# EAGLE design peppermill (EAGLE 9.6.2)
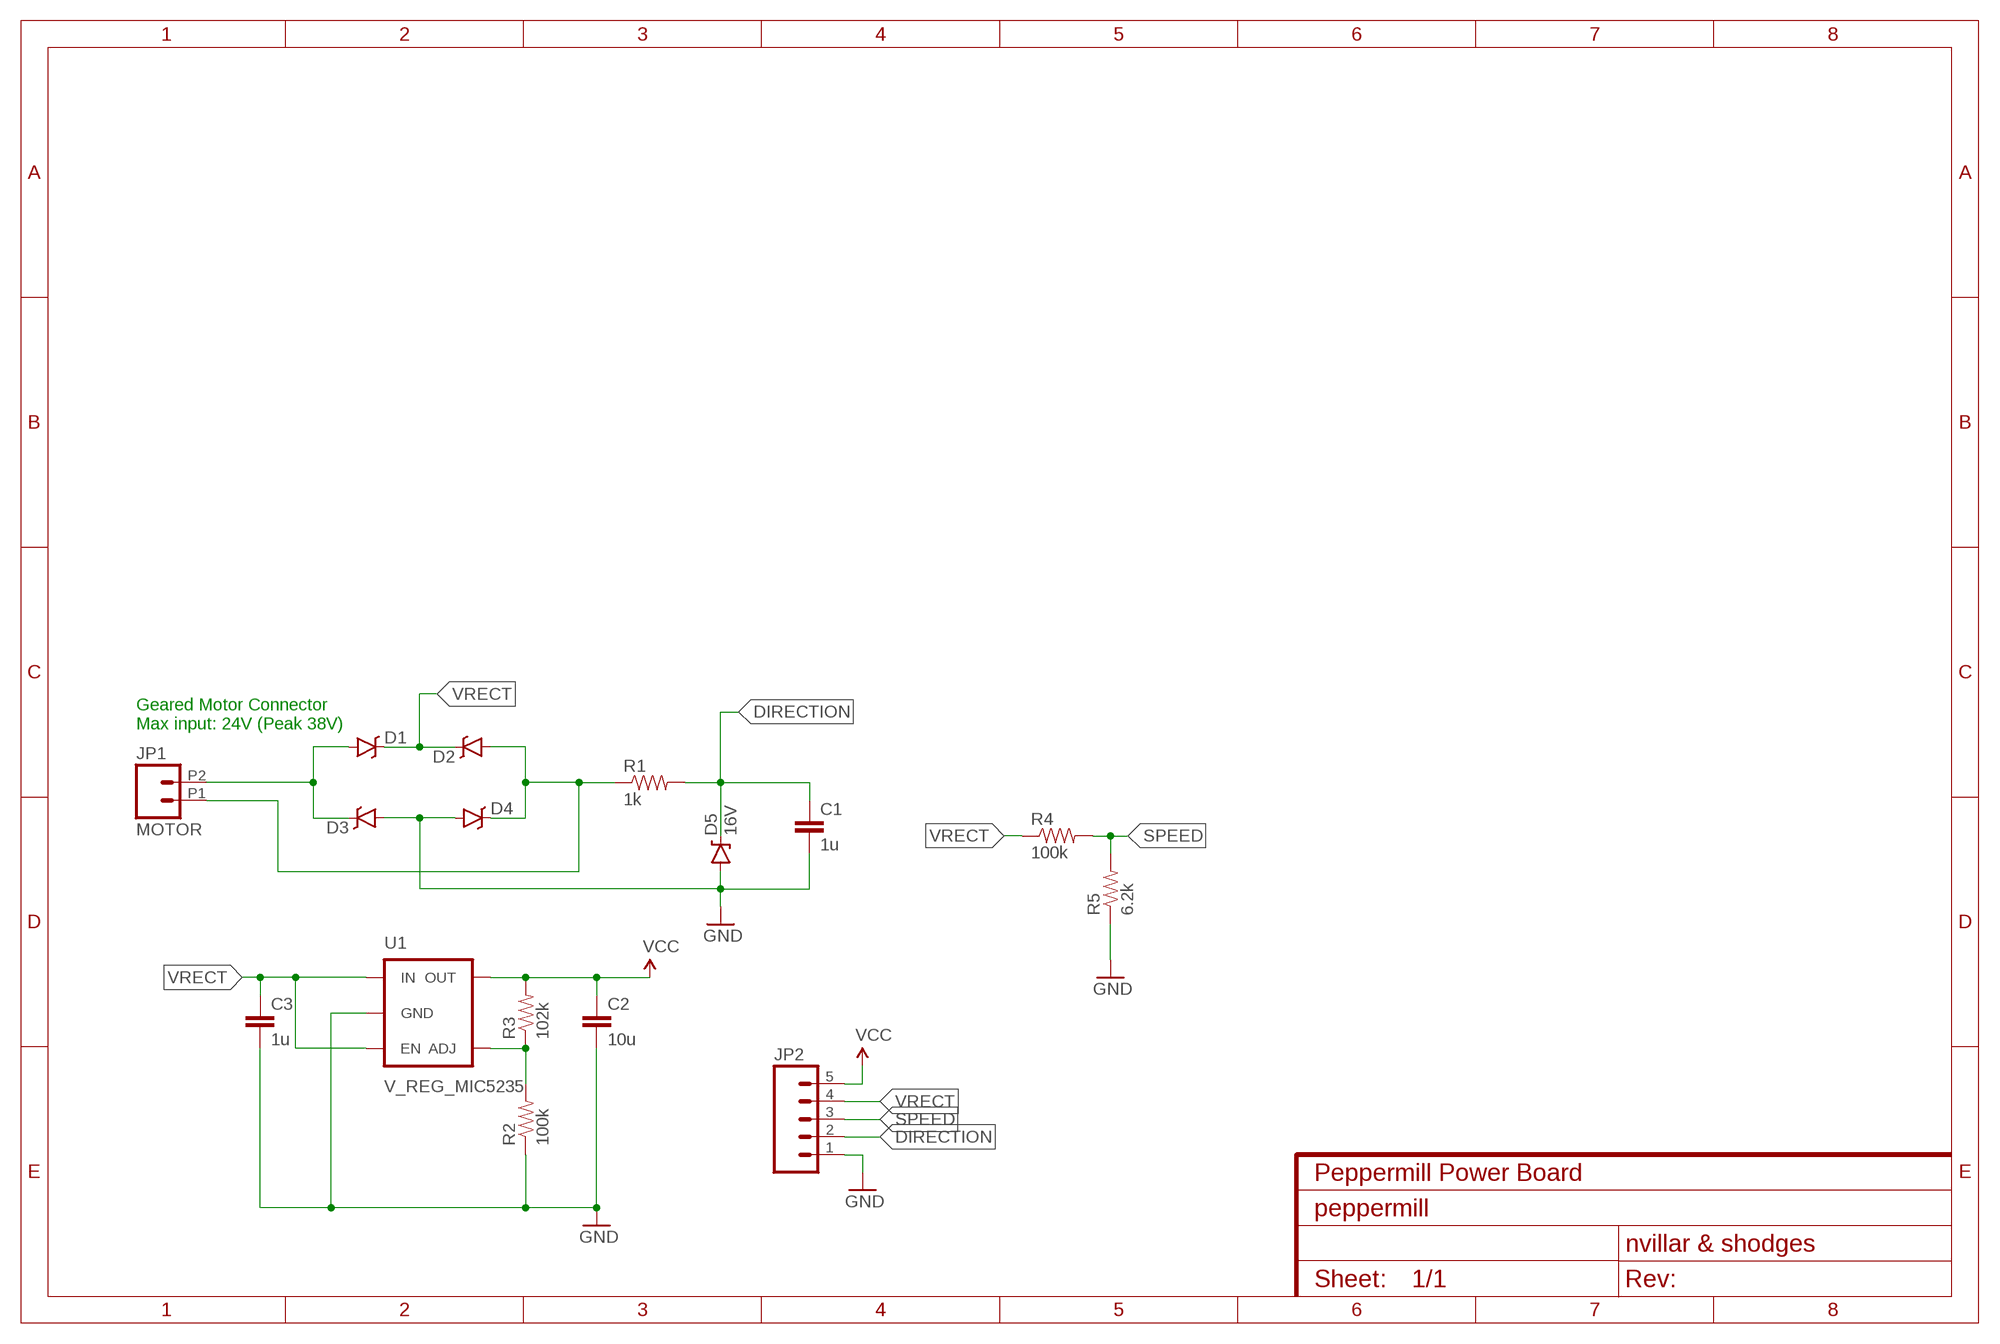
[diagram p0: schematic, sheet 1]
FRAME1 (FRAME-A4L): CNAME: Peppermill Power Board; DESIGNER: nvillar & shodges

## Parts
C1  1u  CAP0805  [0805]
C2  10u  CAP0805  [0805]
C3  1u  CAP0805  [0805]
D1  BAT20JFILM  [SOD-323]
D2  BAT20JFILM  [SOD-323]
D3  BAT20JFILM  [SOD-323]
D4  BAT20JFILM  [SOD-323]
D5  16V  DIODE-ZENER16V  [SOD-123]
JP1  MOTOR  M022.54MM_SCREWTERM  [1X02_2.54_SCREWTERM]
JP2  M05LOCK  [1X05_LOCK]
R1  1k  RESISTOR0805-RES  [0805]
R2  100k  RESISTOR0805-RES  [0805]
R3  102k  RESISTOR0805-RES  [0805]
R4  100k  RESISTOR0805-RES  [0805]
R5  6.2k  RESISTOR0805-RES  [0805]
U1  V_REG_MIC5235  [SOT23-5]

## Nets
DIRECTION: C1.1 D5.C JP2.2 R1.2
GND: C1.2 C2.2 C3.2 D3.A D4.A D5.A JP2.1 R2.1 R5.1 U1.2(GND)
N$1: R2.2 R3.1 U1.4(ADJ)
N$3: D1.A D3.C JP1.P2
N$4: D2.A D4.C JP1.P1 R1.1
SPEED: JP2.3 R4.2 R5.2
VCC: C2.1 JP2.5 R3.2 U1.5(OUT)
VRECT: C3.1 D1.C D2.C JP2.4 R4.1 U1.1(IN) U1.3(EN)

## Notes on the sheet
- Geared Motor Connector
  Max input: 24V (Peak 38V)

## Library data of the parts
C1-C3 = SparkFun-Passives:CAP: Capacitor Standard 0603 ceramic capacitor, and 0.1" leaded capacitor.
D1-D4 = SparkFun-DiscreteSemi:BAT20JFILM: 23V, 1A Schottky diode, SOD-323 package; DIGIKEY: 1727-3877-1-ND; PROD_ID: DIO-11623; VALUE: BAT20JFILM
D5 = SparkFun-DiscreteSemi:DIODE-ZENER: Zener Diode Production Part - 8199 3.4V Zener Voltage; DIGIKEY: 1727-3600-1-ND; PROD_ID: DIO-12440
JP1 = SparkFun-Connectors:M02: Standard 2-pin 0.1" header. Use with - straight break away headers ( PRT-00116) - right angle break away headers (PRT-00553) - swiss pins (PRT-00743) - machine pins (PRT-00117) - female headers (PRT-00115) Molex polarized connector foot print use with: PRT-08233 with associated crimp pins and housings. 2.54_SCREWTERM for use with PRT-10571. 3.5mm Screw Terminal footprints for PRT-08084 5mm Screw Terminal footprints for use with PRT-08432
JP2 = SparkFun-Connectors:M05: Header 5 Standard 5-pin 0.1" header. Use with straight break away headers (SKU : PRT-00116), right angle break away headers (PRT-00553), swiss pins (PRT-00743), machine pins (PRT-00117), and female headers (PRT-00115). Molex polarized connector foot print use with SKU : PRT-08230 with associated crimp pins and housings.
R1-R5 = SparkFun-Passives:RESISTOR: Resistor Basic schematic elements and footprints for 0603, 1206, and PTH resistors.
U1 = SparkFun-PowerIC:V_REG_MIC5235; DIGIKEY: 576-1284-1-ND

## Board
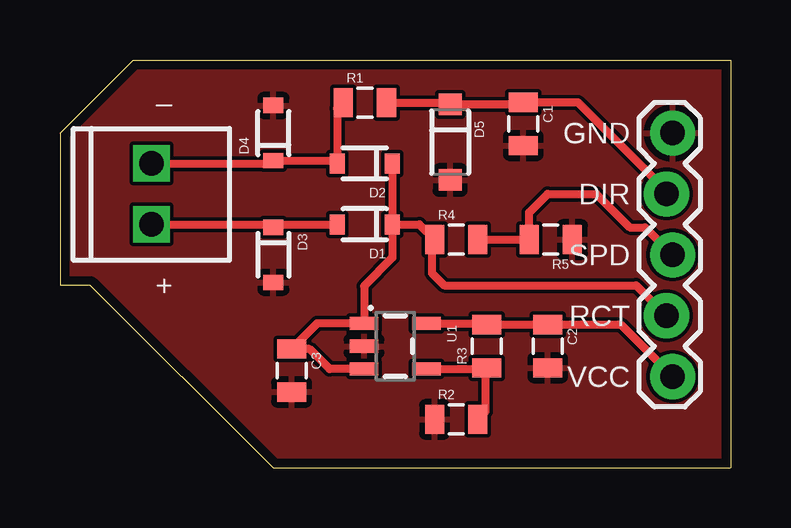
[diagram p1: board, top side]
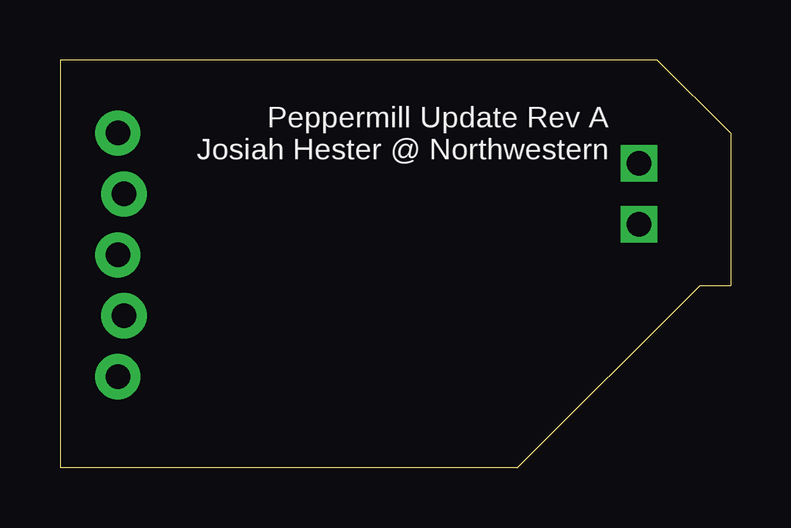
[diagram p2: board, bottom side, seen from below]

Size 27.94 x 17.02 mm. Coordinates in mm from the lower left corner, seen from the top.
Outline: 27.92,0 8.89,0 1.27,7.62 0,7.62 0,13.97 3.05,17.02 27.94,17.02 27.94,0
Copper layers (1*16): Top 0.035559375mm / dielectric 1.6mm / Bottom 0.035559375mm
Design rules "oshpark-2layer": minimum track width 6mil, minimum drill 10mil, track to track 6mil, track to pad 6mil, pad to pad 6mil, via to via 6mil, smd to smd 6mil, copper to edge 15mil, drill to drill 6mil, minimum pad ring 5mil, minimum via ring 5mil, stop-mask expansion 2.5mil, vias tented up to drill 0mil, thermal gap 10mil

### Footprints (pad centres in the part's own frame; a part is rotated, then mirrored left to right if it is on the bottom)
0805 = smd 0.8 x 1.2: 1 -0.9,0; 2 0.9,0
SOD-323 = smd 0.63 x 0.83: A 1.15,0; C -1.15,0
SOD-123 = smd 0.9 x 0.95: A 1.575,0; C -1.575,0
1X02_2.54_SCREWTERM = drill 1.016 square: P1 2.54,0; P2 0,0
1X05_LOCK = drill 1.016 pad 1.88: 1 0,0.127; 2 2.54,-0.127; 3 5.08,0.127; 4 7.62,-0.127; 5 10.16,0.127
SOT23-5 = smd 0.55 x 1.2: 1 -0.95,-1.3; 2 0,-1.3; 3 0.95,-1.3; 4 0.95,1.3; 5 -0.95,1.3

### Placement (x,y rotation side)
C1  19.3,14.35 270 top
C2  20.32,5.08 270 top
C3  9.65,4.06 270 top
D1  12.7,10.16 180 top
D2  12.7,12.7 180 top
D3  8.89,8.89 270 top
D4  8.89,13.97 90 top
D5  16.26,13.59 270 top
JP1  3.81,10.16 90 top
JP2  25.4,13.97 270 top
R1  12.7,15.24 0 top
R2  16.51,2.03 0 top
R3  17.78,5.08 90 top
R4  16.51,9.53 0 top
R5  20.45,9.53 180 top
U1  13.97,5.08 270 top

### Tracks (layer width: path | path; a pad name or v marks a point on that pad's centre or on a via)
DIRECTION
  Top 0.33: R1.2 16.18,15.24 D5.C 19.22,15.16 C1.1 21.58,15.25 25.27,11.56 JP2.2
GND
  pour Top: -1.27,19.05 31.75,19.05 31.75,0 -1.27,0
N$1
  Top 0.33: U1.4 17.73,4.13 | 17.73,4.13 R3.1 | R2.2 17.73,2.35 17.73,4.13
N$3
  Top 0.33: JP1.P2 8.77,10.16 D3.C 9.01,10.16 D1.A
N$4
  Top 0.33: JP1.P1 8.77,12.7 D4.C 11.43,12.82 D2.A 11.55,14.99 R1.1
SPEED
  Top 0.33: R4.2 R5.2 19.55,10.66 20.32,11.43 22.35,11.43 23.75,10.03 24.38,10.03 JP2.3
VCC
  Top 0.33: U1.5 17.73,6.03 R3.2 C2.1 23.36,5.98 JP2.5
VRECT
  Top 0.33: U1.3 11.24,4.13 10.4,4.96 C3.1 10.72,6.03 U1.1 12.67,7.59 13.85,8.77 D1.C | D2.C D1.C | D1.C 14.97,10.16 R4.1 15.49,9.41 15.49,8.13 16,7.62 24,7.62 JP2.4

### Text on the board
tPlace: – | GND | DIR | SPD | + | RCT | VCC
bPlace: Peppermill Update Rev A / Josiah Hester @ Northwestern